# Altium schematic sheet Schematics_5.SchDoc
size 699 x 600 mm; SheetNumber: 1; SheetTotal: 1
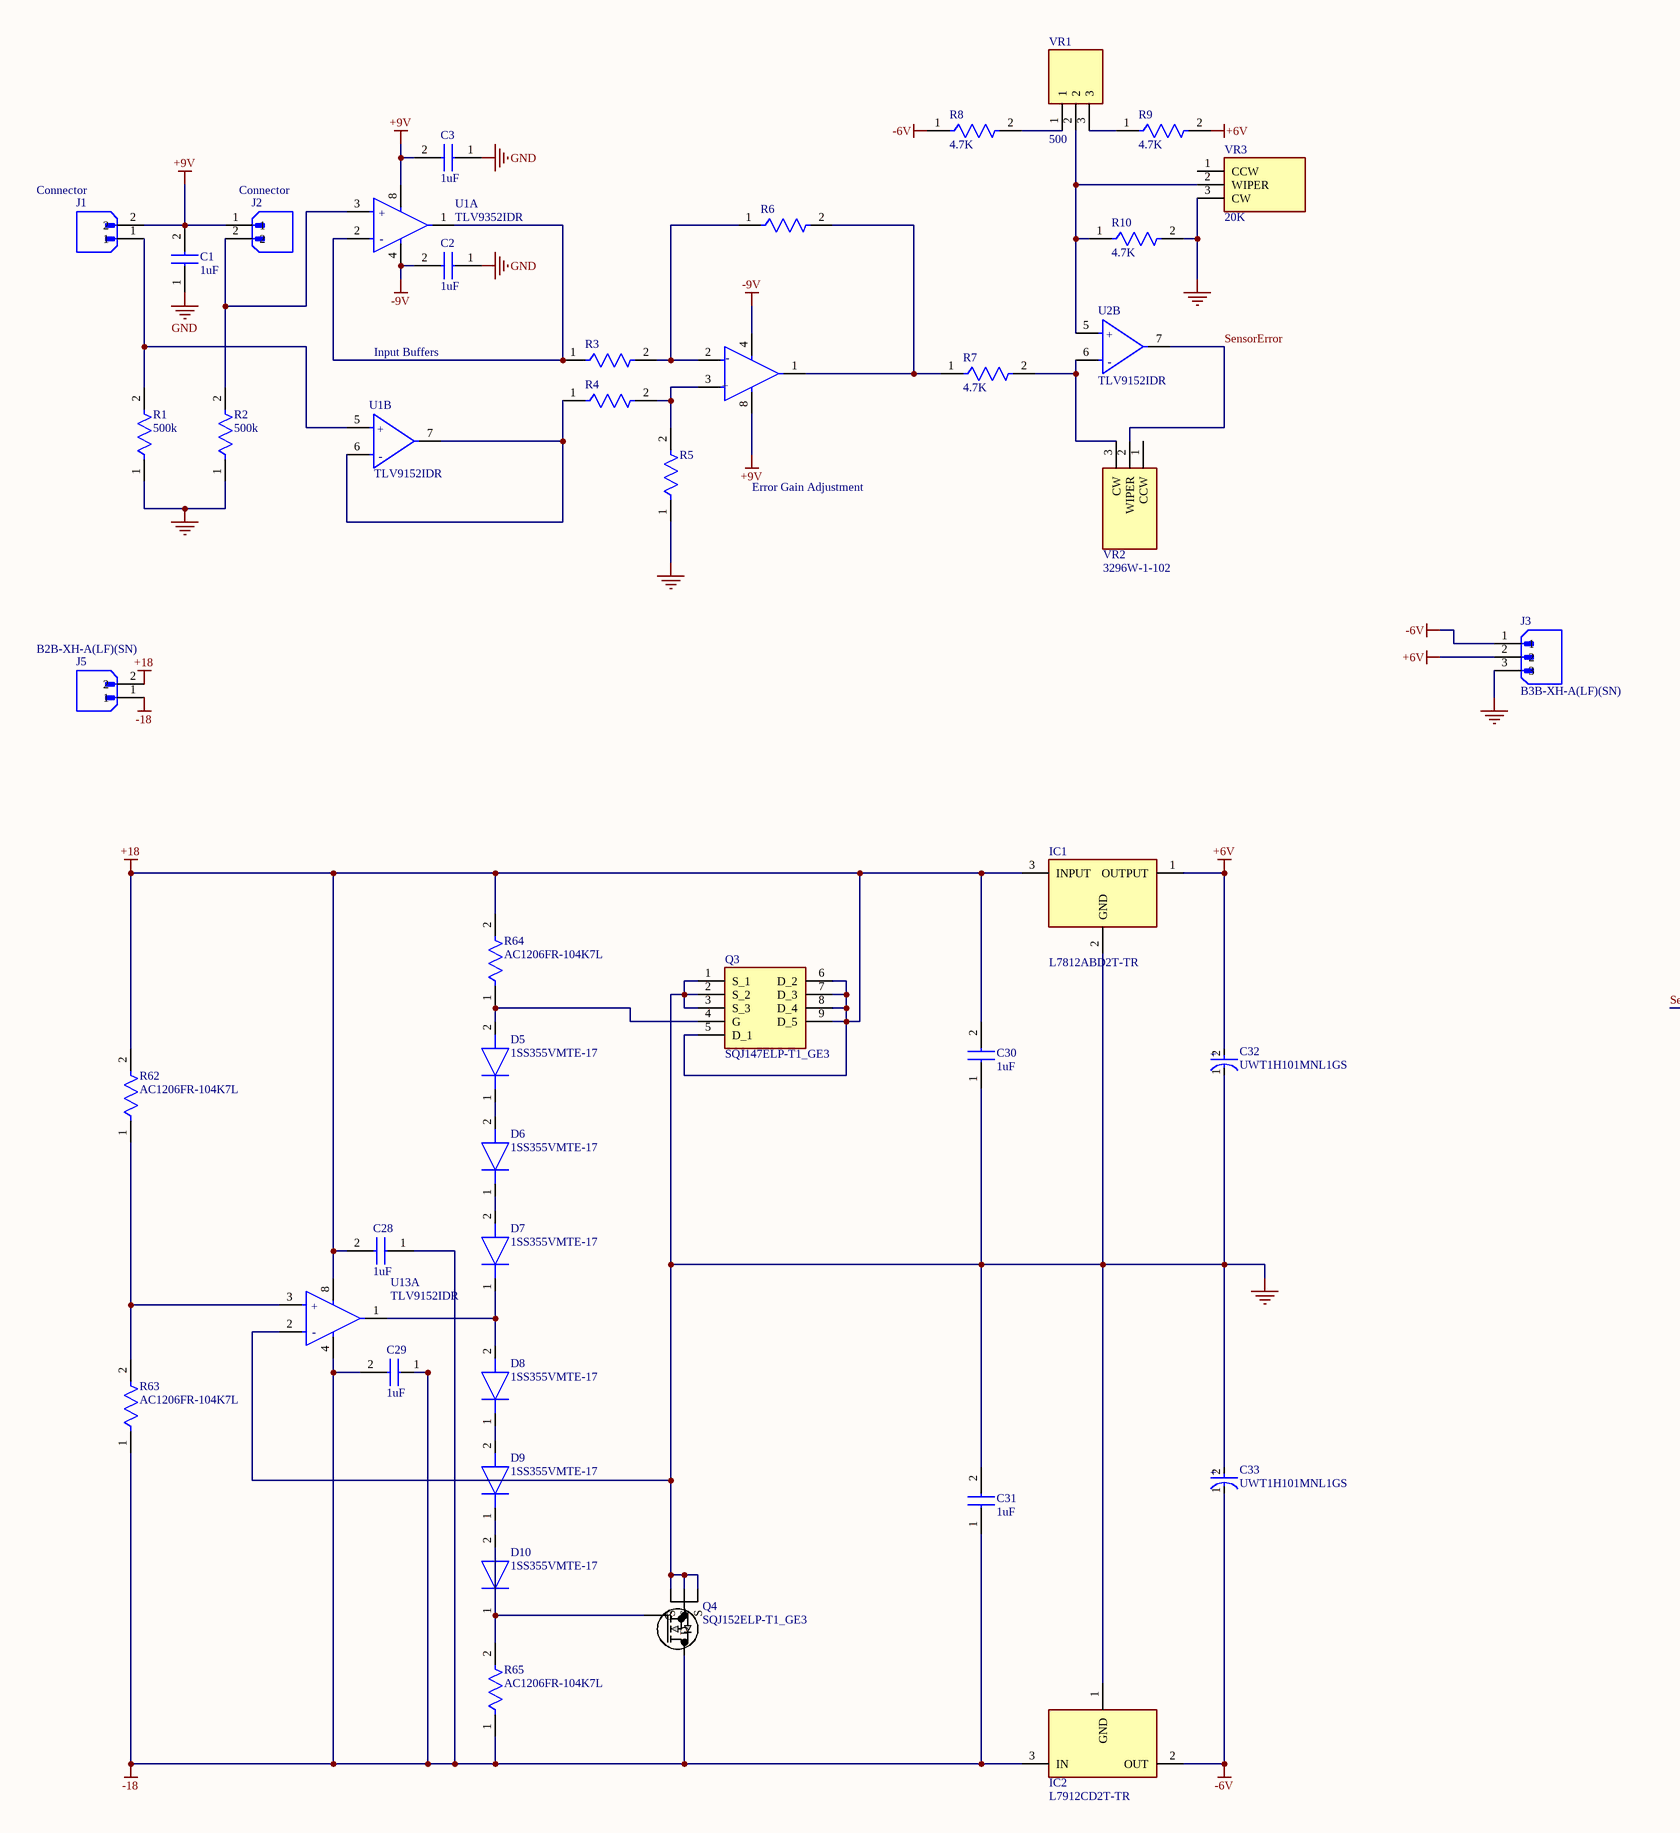
[diagram p0: Schematics_5.SchDoc, top left]
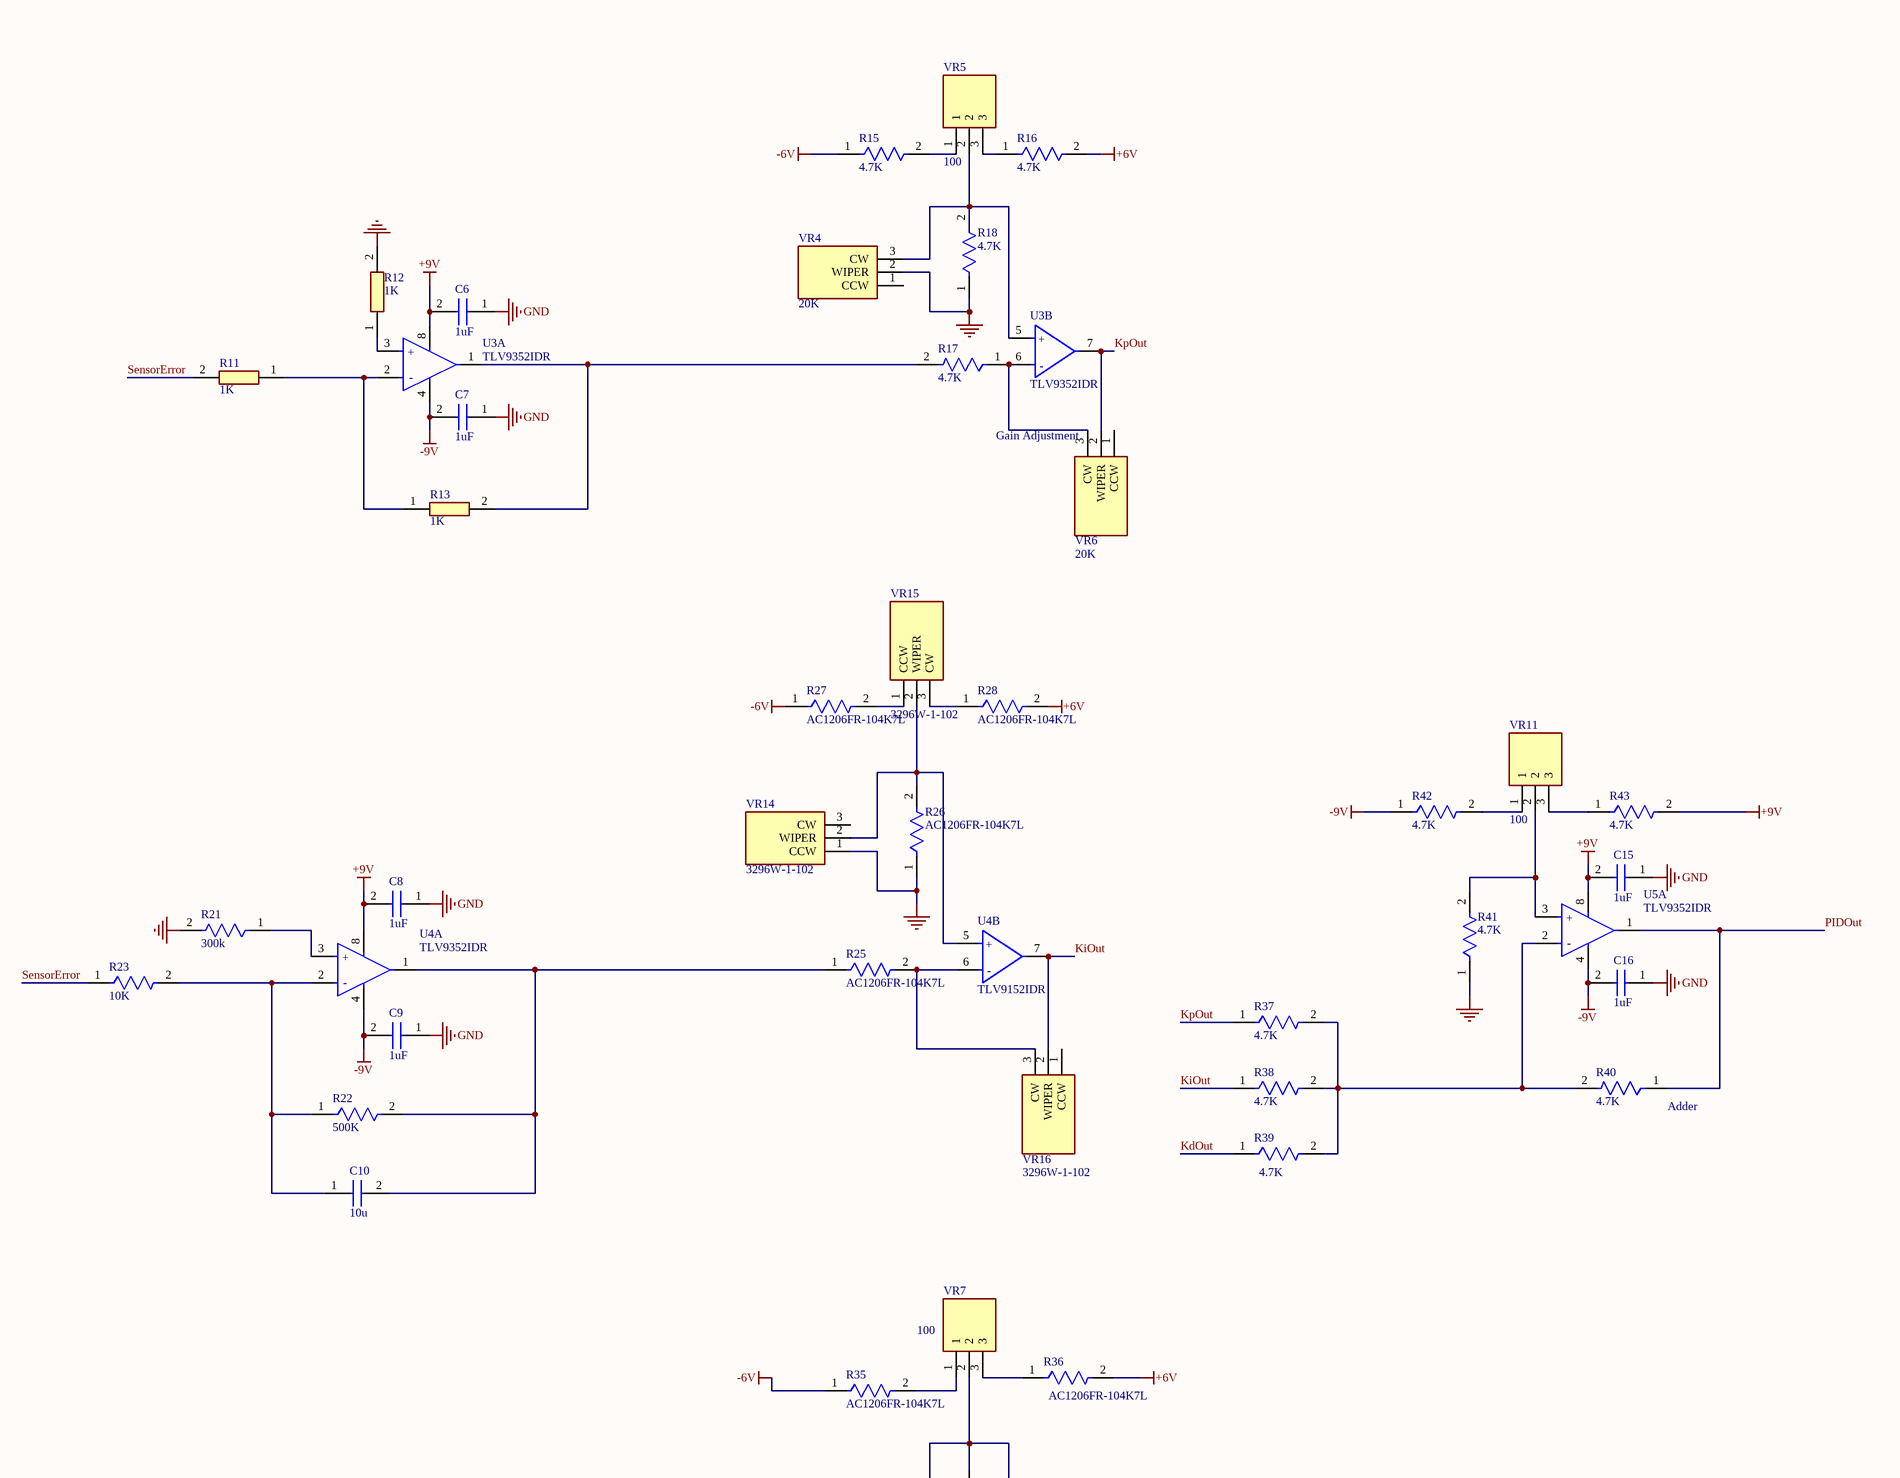
[diagram p1: Schematics_5.SchDoc, top right]
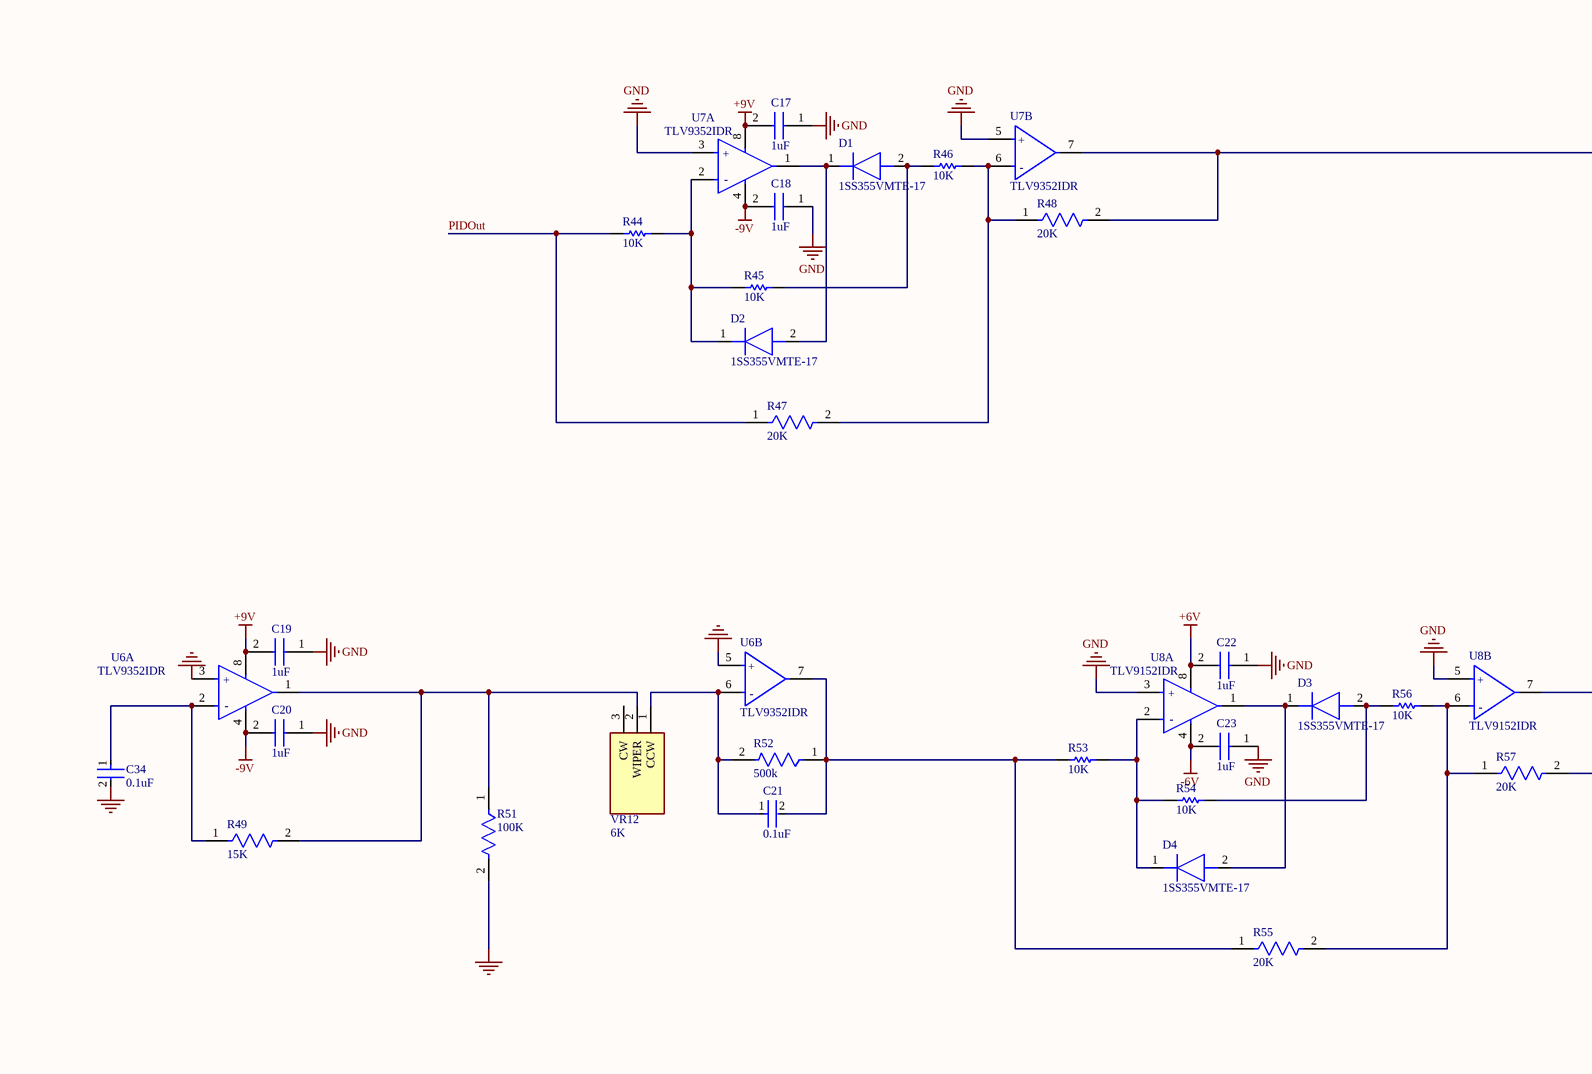
[diagram p2: Schematics_5.SchDoc, bottom left]
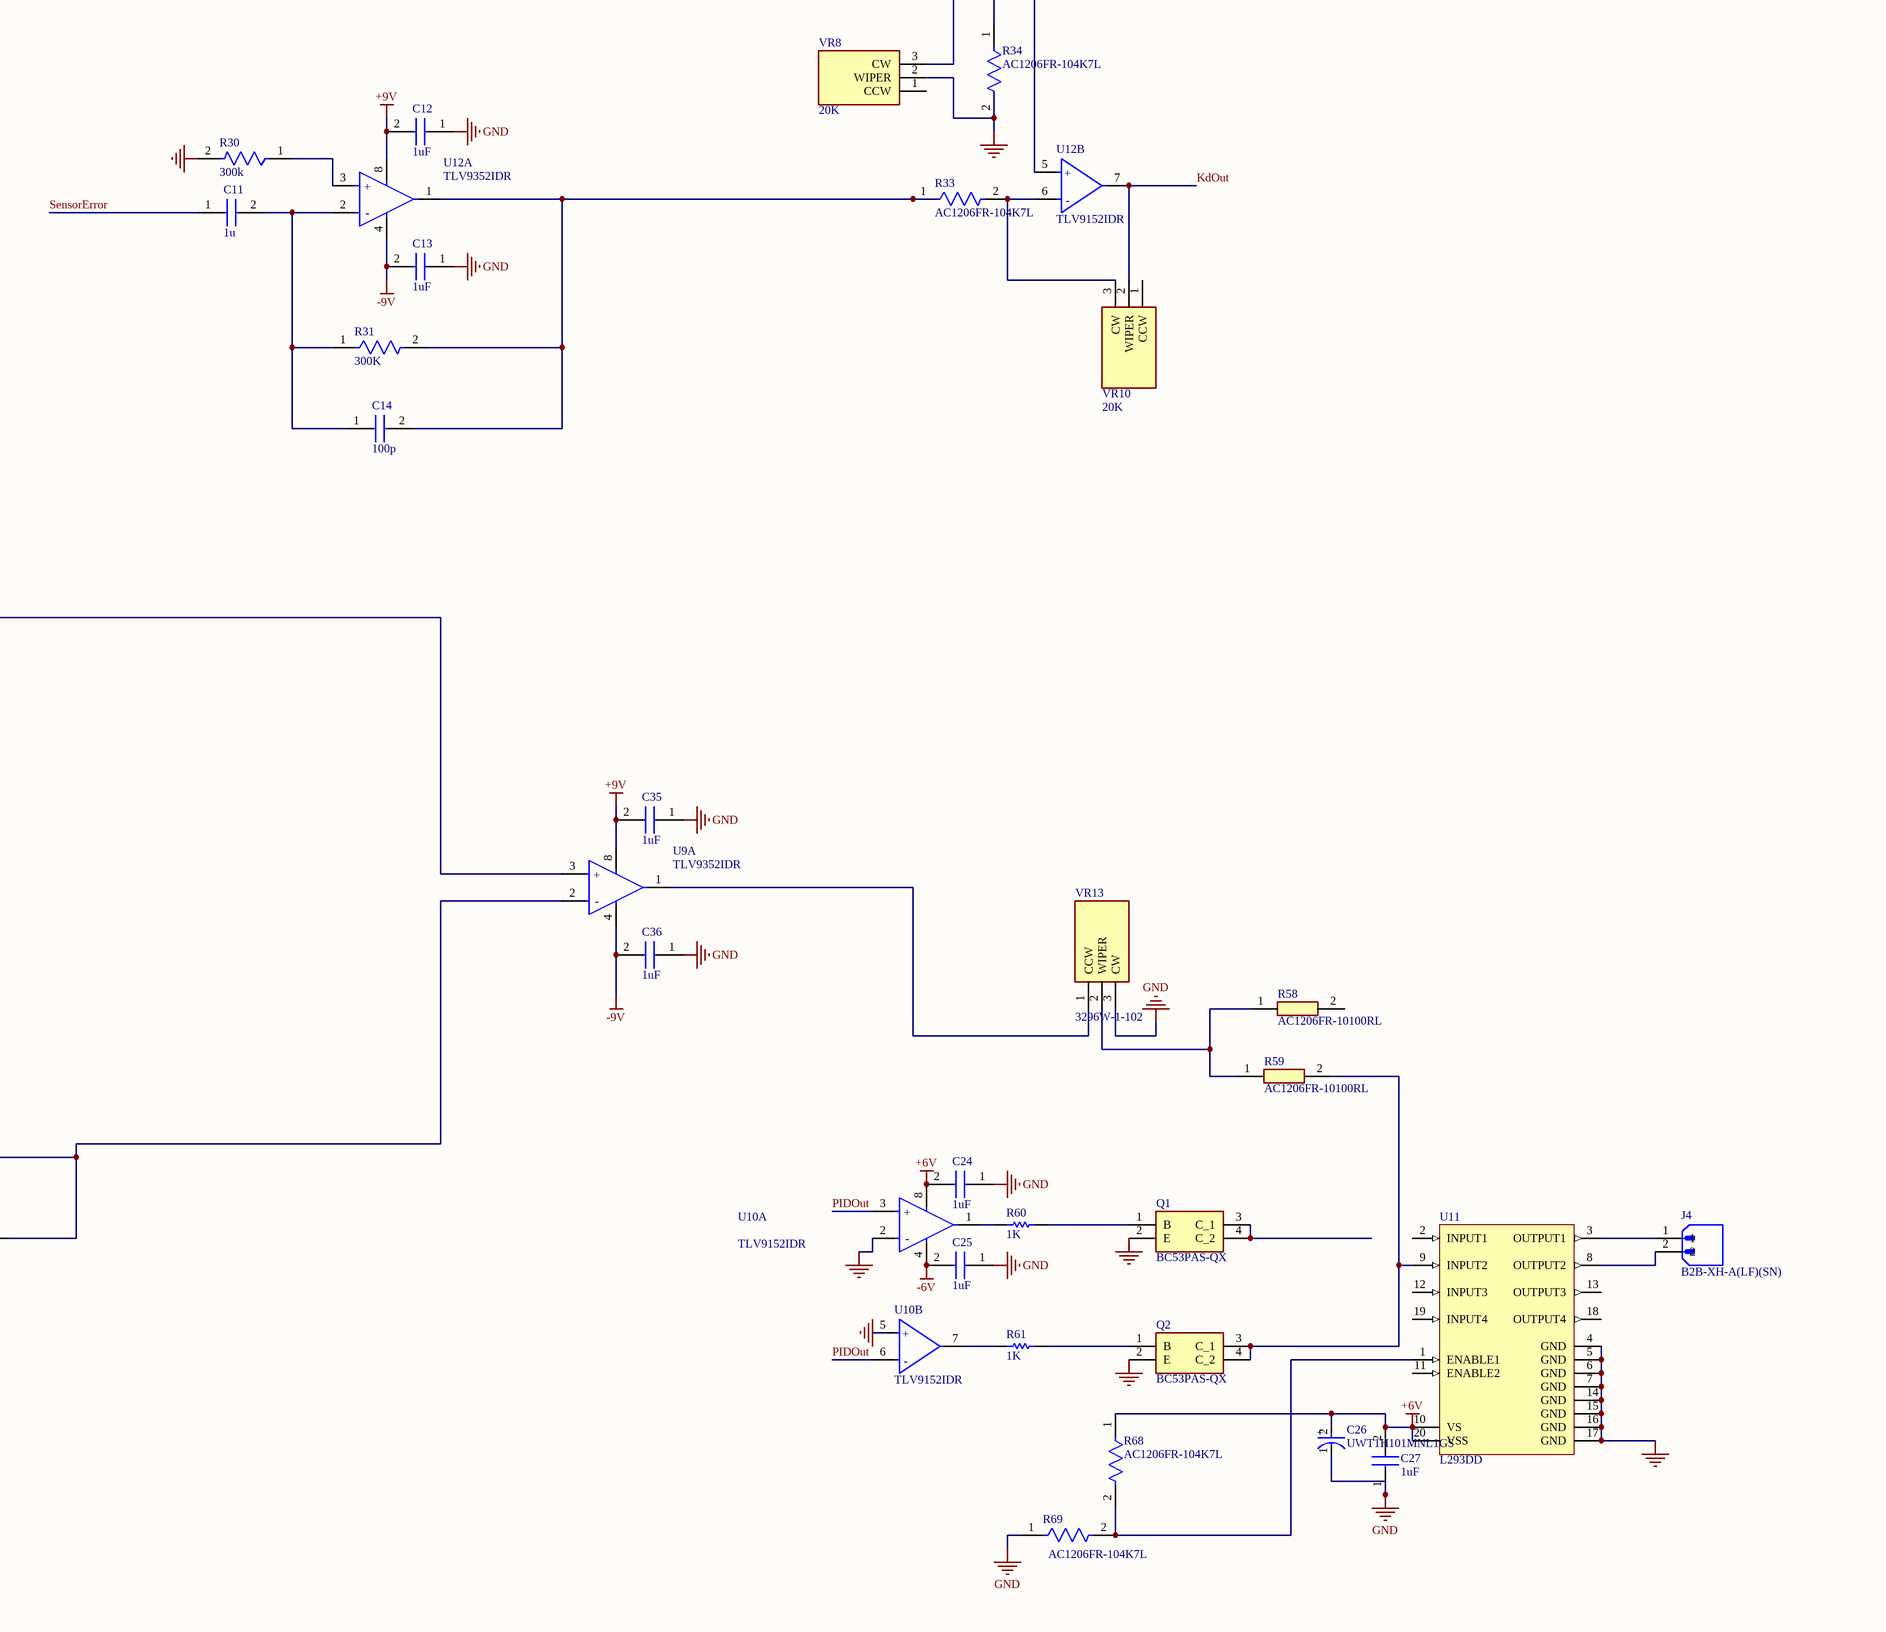
[diagram p3: Schematics_5.SchDoc, bottom right]

## Parts
C1  1uF  [CAPC3216X178N]
C2  1uF  [CAPC3216X178N]
C3  1uF  [CAPC3216X178N]
C6  1uF  [CAPC3216X178N]
C7  1uF  [CAPC3216X178N]
C8  1uF  [CAPC3216X178N]
C9  1uF  [CAPC3216X178N]
C10  10u  [CAPC3216X170N]
C11  1u  [C1206_FT]
C12  1uF  [CAPC3216X178N]
C13  1uF  [CAPC3216X178N]
C14  100p  [CAPC3216X170N]
C15  1uF  [CAPC3216X178N]
C16  1uF  [CAPC3216X178N]
C17  1uF  [CAPC3216X178N]
C18  1uF  [CAPC3216X178N]
C19  1uF  [CAPC3216X178N]
C20  1uF  [CAPC3216X178N]
C21  0.1uF  [FP-C1206C-EB-MFG]
C22  1uF  [CAPC3216X178N]
C23  1uF  [CAPC3216X178N]
C24  1uF  [CAPC3216X178N]
C25  1uF  [CAPC3216X178N]
C26  UWT1H101MNL1GS  [FP-UWT1H101MNL1GS-MFG]
C27  1uF  [CAPC3216X178N]
C28  1uF  [CAPC3216X178N]
C29  1uF  [CAPC3216X178N]
C30  1uF  [CAPC3216X178N]
C31  1uF  [CAPC3216X178N]
C32  UWT1H101MNL1GS  [FP-UWT1H101MNL1GS-MFG]
C33  UWT1H101MNL1GS  [FP-UWT1H101MNL1GS-MFG]
C34  0.1uF  [FP-C1206C-EB-MFG]
C35  1uF  [CAPC3216X178N]
C36  1uF  [CAPC3216X178N]
D1  1SS355VMTE-17  [UDZVTE1722B]
D2  1SS355VMTE-17  [UDZVTE1722B]
D3  1SS355VMTE-17  [UDZVTE1722B]
D4  1SS355VMTE-17  [UDZVTE1722B]
D5  1SS355VMTE-17  [UDZVTE1722B]
D6  1SS355VMTE-17  [UDZVTE1722B]
D7  1SS355VMTE-17  [UDZVTE1722B]
D8  1SS355VMTE-17  [UDZVTE1722B]
D9  1SS355VMTE-17  [UDZVTE1722B]
D10  1SS355VMTE-17  [UDZVTE1722B]
IC1  L7812ABD2T-TR  [L7812ABD2TTR]
IC2  L7912CD2T-TR  [L7905CD2TTR]
J1  Connector  [JST_B2B-XH-A(LF)(SN)]
J2  Connector  [JST_B2B-XH-A(LF)(SN)]
J3  B3B-XH-A(LF)(SN)  [JST_B3B-XH-A(LF)(SN)]
J4  B2B-XH-A(LF)(SN)  [JST_B2B-XH-A(LF)(SN)]
J5  B2B-XH-A(LF)(SN)  [JST_B2B-XH-A(LF)(SN)]
Q1  BC53PAS-QX  [BC53PASQX]
Q2  BC53PAS-QX  [BC53PASQX]
Q3  SQJ147ELP-T1_GE3  [SQJ147ELPT1_GE3]
Q4  SQJ152ELP-T1_GE3  [DPAK5_ELP-T1_GE3_VIS]
R1  500k  [FP-CRMA1206-IPC_A]
R2  500k  [FP-CRMA1206-IPC_A]
R3  4.7K  [FP-AC1206-MFG]  (value not drawn)
R4  4.7K  [FP-AC1206-MFG]  (value not drawn)
R5  4.7K  [FP-AC1206-MFG]  (value not drawn)
R6  4.7K  [FP-AC1206-MFG]  (value not drawn)
R7  4.7K  [FP-AC1206-MFG]
R8  4.7K  [FP-AC1206-MFG]
R9  4.7K  [FP-AC1206-MFG]
R10  4.7K  [FP-AC1206-MFG]
R11  1K  [RESC3116X65N]
R12  1K  [RESC3116X65N]
R13  1K  [RESC3116X65N]
R15  4.7K  [FP-AC1206-MFG]
R16  4.7K  [FP-AC1206-MFG]
R17  4.7K  [FP-AC1206-MFG]
R18  4.7K  [FP-AC1206-MFG]
R21  300k  [FP-ESR18-IPC_C]
R22  500K  [FP-ESR18-IPC_C]
R23  10K  [FP-ESR18-IPC_C]
R25  AC1206FR-104K7L  [FP-AC1206-MFG]
R26  AC1206FR-104K7L  [FP-AC1206-MFG]
R27  AC1206FR-104K7L  [FP-AC1206-MFG]
R28  AC1206FR-104K7L  [FP-AC1206-MFG]
R30  300k  [FP-ESR18-IPC_C]
R31  300K  [FP-ESR18-IPC_C]
R33  AC1206FR-104K7L  [FP-AC1206-MFG]
R34  AC1206FR-104K7L  [FP-AC1206-MFG]
R35  AC1206FR-104K7L  [FP-AC1206-MFG]
R36  AC1206FR-104K7L  [FP-AC1206-MFG]
R37  4.7K  [FP-AC1206-MFG]
R38  4.7K  [FP-AC1206-MFG]
R39  4.7K  [FP-AC1206-MFG]
R40  4.7K  [FP-AC1206-MFG]
R41  4.7K  [FP-AC1206-MFG]
R42  4.7K  [FP-AC1206-MFG]
R43  4.7K  [FP-AC1206-MFG]
R44  10K  [RESC3116X65X40ML10T20]
R45  10K  [RESC3116X65X40ML10T20]
R46  10K  [RESC3116X65X40ML10T20]
R47  20K  [FP-RT1206-MFG]
R48  20K  [FP-RT1206-MFG]
R49  15K  [FP-ERJ8EN-MFG]
R51  100K  [FP-AC1206-MFG]
R52  500k  [FP-CRMA1206-IPC_A]
R53  10K  [RESC3116X65X40ML10T20]
R54  10K  [RESC3116X65X40ML10T20]
R55  20K  [FP-RT1206-MFG]
R56  10K  [RESC3116X65X40ML10T20]
R57  20K  [FP-RT1206-MFG]
R58  AC1206FR-10100RL  [RESC3116X65N]
R59  AC1206FR-10100RL  [RESC3116X65N]
R60  1K  [RESC3216X70X50LL05T20]
R61  1K  [RESC3216X70X50LL05T20]
R62  AC1206FR-104K7L  [FP-AC1206-MFG]
R63  AC1206FR-104K7L  [FP-AC1206-MFG]
R64  AC1206FR-104K7L  [FP-AC1206-MFG]
R65  AC1206FR-104K7L  [FP-AC1206-MFG]
R68  AC1206FR-104K7L  [FP-AC1206-MFG]
R69  AC1206FR-104K7L  [FP-AC1206-MFG]
U1  TLV9352IDR  [FP-D0008A-IPC_A]  (parts A,B of 2)
U2  TLV9352IDR  [FP-D0008A-IPC_A]  (value not drawn)  (parts A,B of 2)
U3  TLV9352IDR  [FP-D0008A-IPC_A]  (parts A,B of 2)
U4  TLV9352IDR  [FP-D0008A-IPC_A]  (parts A,B of 2)
U5  TLV9352IDR  [FP-D0008A-IPC_A]  (part A of 2)
U6  TLV9352IDR  [FP-D0008A-IPC_A]  (parts A,B of 2)
U7  TLV9352IDR  [FP-D0008A-IPC_A]  (parts A,B of 2)
U8  TLV9152IDR  [FP-D0008A-IPC_A]  (parts A,B of 2)
U9  TLV9352IDR  [FP-D0008A-IPC_A]  (part A of 2)
U10  TLV9152IDR  [FP-D0008A-IPC_A]  (parts A,B of 2)
U11  L293DD  [STM-SOIC-20_M]
U12  TLV9352IDR  [FP-D0008A-IPC_A]  (parts A,B of 2)
U13  TLV9152IDR  [FP-D0008A-IPC_A]  (part A of 2)
VR1  500  [3296W-1]
VR2  3296W-1-102  [3296W-1]
VR3  20K  [3296W-1]
VR4  20K  [3296W-1]
VR5  100  [3296W-1]
VR6  20K  [3296W-1]
VR7  100  [3296W-1]
VR8  20K  [3296W-1]
VR10  20K  [3296W-1]
VR11  100  [3296W-1]
VR12  6K  [3296W-1]
VR13  3296W-1-102  [3296W-1]
VR14  3296W-1-102  [3296W-1]
VR15  3296W-1-102  [3296W-1]
VR16  3296W-1-102  [3296W-1]

## Nets
+6V: C22.2 C24.2 C26.2(A) C27.2 C32.2(A) IC1.1(OUTPUT) J3.2 R9.2 R16.2 R28.2 R36.2 R68.1 U8.8(V+) U10.8(V+) U11.10(VS) U11.20(VSS)
+9V: C1.2 C3.2 C6.2 C8.2 C12.2 C15.2 C17.2 C19.2 C35.2 J1.2 J2.1 R43.2 U1.8(V+) U2.8(V+) U3.8(V+) U4.8(V+) U5.8(V+) U6.8(V+) U7.8(V+) U9.8(V+) U12.8(V+)
+18: C28.2 C30.2 IC1.3(INPUT) J5.2 Q3.5(D_1) Q3.6(D_2) Q3.7(D_3) Q3.8(D_4) Q3.9(D_5) R62.2 R64.2 U13.8(V+)
-6V: C23.2 C25.2 C33.1(C) IC2.2(OUT) J3.1 R8.1 R15.1 R27.1 R35.1 U8.4(V-) U10.4(V-)
-9V: C2.2 C7.2 C9.2 C13.2 C16.2 C18.2 C20.2 C36.2 R42.1 U1.4(V-) U2.4(V-) U3.4(V-) U4.4(V-) U5.4(V-) U6.4(V-) U7.4(V-) U9.4(V-) U12.4(V-)
-18: C28.1 C29.1 C29.2 C31.1 IC2.3(IN) J5.1 Q4.5(D) R63.1 R65.1 U13.4(V-)
GND: C1.1 C2.1 C3.1 C6.1 C7.1 C8.1 C9.1 C12.1 C13.1 C15.1 C16.1 C17.1 C18.1 C19.1 C20.1 C22.1 C23.1 C24.1 C25.1 C26.1(C) C27.1 C30.1 C31.2 C32.1(C) C33.2(A) C34.2 C35.1 C36.1 IC1.2(GND) IC2.1(GND) J3.3 Q1.2(E) Q2.2(E) Q3.1(S_1) Q3.2(S_2) Q3.3(S_3) Q4.1(S) Q4.2(S) Q4.3(S) R1.1 R2.1 R5.1 R10.2 R12.2 R18.1 R21.2 R26.1 R30.2 R34.2 R41.1 R51.2 R69.1 U6.3(IN1+) U6.5(IN2+) U7.3(IN1+) U7.5(IN2+) U8.3(IN1+) U8.5(IN2+) U10.2(IN1-) U10.5(IN2+) U11.4(GND) U11.5(GND) U11.6(GND) U11.7(GND) U11.14(GND) U11.15(GND) U11.16(GND) U11.17(GND) U13.2(IN1-) VR3.3(CW) VR4.2(WIPER) VR8.2(WIPER) VR13.3(CW) VR14.1(CCW)
KdOut: R39.1 U12.7(OUT2) VR10.2(WIPER)
KiOut: R38.1 U4.7(OUT2) VR16.2(WIPER)
KpOut: R37.1 U3.7(OUT2) VR6.2(WIPER)
PIDOut: R40.1 R44.1 R47.1 U5.1(OUT1) U10.3(IN1+) U10.6(IN2-)
SensorError: C11.1 R11.2 R23.1 U2.7(OUT2) VR2.2(WIPER)
NetC10_1: C10.1 R22.1 R23.2 U4.2(IN1-)
NetC10_2: C10.2 R22.2 R25.1 U4.1(OUT1)
NetC11_2: C11.2 C14.1 R31.1 U12.2(IN1-)
NetC14_2: C14.2 R31.2 R33.1 U12.1(OUT1)
NetC21_1: C21.1 R52.2 U6.6(IN2-) VR12.1(CCW)
NetC21_2: C21.2 R52.1 R53.1 R55.1 U6.7(OUT2)
NetC34_1: C34.1 R49.1 U6.2(IN1-)
NetD1_1: D1.1(K) D2.2(A) U7.1(OUT1)
NetD1_2: D1.2(A) R45.2 R46.1
NetD2_1: D2.1(K) R44.2 R45.1 U7.2(IN1-)
NetD3_1: D3.1(K) D4.2(A) U8.1(OUT1)
NetD3_2: D3.2(A) R54.2 R56.1
NetD4_1: D4.1(K) R53.2 R54.1 U8.2(IN1-)
NetD5_1: D5.1(K) D6.2(A)
NetD5_2: D5.2(A) Q3.4(G) R64.1
NetD6_1: D6.1(K) D7.2(A)
NetD7_1: D7.1(K) D8.2(A) U13.1(OUT1)
NetD8_1: D8.1(K) D9.2(A)
NetD9_1: D9.1(K) D10.2(A)
NetD10_1: D10.1(K) Q4.4(G) R65.2
NetJ1_1: J1.1 R1.2 U1.5(IN2+)
NetJ2_2: J2.2 R2.2 U1.3(IN1+)
NetJ4_1: J4.1 U11.3(OUTPUT1)
NetJ4_2: J4.2 U11.8(OUTPUT2)
NetQ1_1: Q1.1(B) R60.2
NetQ1_3: Q1.3(C_1) Q1.4(C_2)
NetQ2_1: Q2.1(B) R61.2
NetQ2_3: Q2.3(C_1) Q2.4(C_2) R59.2 U11.9(INPUT2)
NetR3_1: R3.1 U1.1(OUT1) U1.2(IN1-)
NetR3_2: R3.2 R6.1 U2.2(IN1-)
NetR4_1: R4.1 U1.6(IN2-) U1.7(OUT2)
NetR4_2: R4.2 R5.2 U2.3(IN1+)
NetR6_2: R6.2 R7.1 U2.1(OUT1)
NetR7_2: R7.2 U2.6(IN2-) VR2.3(CW)
NetR8_2: R8.2 VR1.1
NetR9_1: R9.1 VR1.3
NetR10_1: R10.1 U2.5(IN2+) VR1.2 VR3.2(WIPER)
NetR11_1: R11.1 R13.1 U3.2(IN1-)
NetR12_1: R12.1 U3.3(IN1+)
NetR13_2: R13.2 R17.2 U3.1(OUT1)
NetR15_2: R15.2 VR5.1
NetR16_1: R16.1 VR5.3
NetR17_1: R17.1 U3.6(IN2-) VR6.3(CW)
NetR18_2: R18.2 U3.5(IN2+) VR4.3(CW) VR5.2
NetR21_1: R21.1 U4.3(IN1+)
NetR25_2: R25.2 U4.6(IN2-) VR16.3(CW)
NetR26_2: R26.2 U4.5(IN2+) VR14.2(WIPER) VR15.2(WIPER)
NetR27_2: R27.2 VR15.1(CCW)
NetR28_1: R28.1 VR15.3(CW)
NetR30_1: R30.1 U12.3(IN1+)
NetR33_2: R33.2 U12.6(IN2-) VR10.3(CW)
NetR34_1: R34.1 U12.5(IN2+) VR7.2 VR8.3(CW)
NetR35_2: R35.2 VR7.1
NetR36_1: R36.1 VR7.3
NetR37_2: R37.2 R38.2 R39.2 R40.2 U5.2(IN1-)
NetR41_2: R41.2 U5.3(IN1+) VR11.2
NetR42_2: R42.2 VR11.1
NetR43_1: R43.1 VR11.3
NetR46_2: R46.2 R47.2 R48.1 U7.6(IN2-)
NetR48_2: R48.2 U7.7(OUT2) U9.3(IN1+)
NetR49_2: R49.2 R51.1 U6.1(OUT1) VR12.2(WIPER)
NetR55_2: R55.2 R56.2 R57.1 U8.6(IN2-)
NetR57_2: R57.2 U8.7(OUT2) U9.2(IN1-)
NetR58_1: R58.1 R59.1 VR13.2(WIPER)
NetR60_1: R60.1 U10.1(OUT1)
NetR61_1: R61.1 U10.7(OUT2)
NetR62_1: R62.1 R63.2 U13.3(IN1+)
NetR68_2: R68.2 R69.2 U11.1(ENABLE1)
NetU9_1: U9.1(OUT1) VR13.1(CCW)

Not connected (* = marked no-connect by the designer): R58 2; U11 2(INPUT1) 11(ENABLE2) 12(INPUT3) 13(OUTPUT3) 18(OUTPUT4) 19(INPUT4); VR2 1(CCW); VR3 1(CCW); VR4 1(CCW); VR6 1(CCW); VR8 1(CCW); VR10 1(CCW); VR12 3(CW); VR14 3(CW); VR16 1(CCW)

## Notes on the sheet
- Input Buffers
- (near VR6) Gain Adjustment
- Error Gain Adjustment
- (near R40) Adder
- (in symbol CMP-2000-07373-2) +
- (in symbol CMP-04895-000148-1, part A) +; -
- (in symbol CMP-04895-000148-1, part B) +; -

## Library data of the parts
C1-C3 C6-C9 C12 C13 C15-C20 C22-C25 C27-C31 C35 C36 = 12063C105MAT2A: Capacitor 12063C105MAT2A; Manufacturer_Name: AVX; Datasheet Link: https://spicat.kyocera-avx.com/product/mlcc/chartview/12063C105MAT2A/DataSheet/X7R; Height: 1.78mm; Manufacturer_Part_Number: 12063C105MAT2A; Mouser Part Number: 581-12063C105MAT2A; Mouser Price/Stock: https://www.mouser.com/Search/Refine.aspx?Keyword=581-12063C105MAT2A; Arrow Part Number: 12063C105MAT2A; Arrow Price/Stock: https://www.arrow.com/en/products/12063c105mat2a/avx
C10 C14 = VJ1206A101JXEAT: Capacitor; Manufacturer_Name: Vishay; Datasheet Link: http://www.vishay.com/docs/45200/vjhirelseries.pdf; Height: 1.7mm; Manufacturer_Part_Number: VJ1206A101JXEAT; Mouser Part Number: 77-VJ1206A101JXEAT; Mouser Price/Stock: https://www.mouser.co.uk/ProductDetail/Vishay-Vitramon/VJ1206A101JXEAT?qs=RFK7ThnmtPvk1pY6DbPviw%3D%3D; Arrow Part Number: VJ1206A101JXEAT; Arrow Price/Stock: https://www.arrow.com/en/products/vj1206a101jxeat/vishay
C11 = C1206X105J1RACTU: Capacitor; Manufacturer_Name: KEMET; Datasheet Link: https://content.kemet.com/datasheets/KEM_C1013_X7R_FT-CAP_SMD.pdf; Manufacturer_Part_Number: C1206X105J1RACTU; Mouser Part Number: 80-C1206X105J1R; Mouser Price/Stock: https://www.mouser.co.uk/ProductDetail/KEMET/C1206X105J1RACTU?qs=s6nfgz3miVxU9JVY4HzXlQ%3D%3D
C21 C34 = CMP-1037-04186-2: CAP CER 0.1UF 25V C0G/NP0 1206; Manufacturer: KEMET; Manufacturer Part Number: C1206C104F3GACTU; Material: Ceramic; Value: 0.10 μF; Temperature Characteristic: C0G; Temperature Coefficient: 15%; Tolerance: 0.01; Automotive Grade: Grade 0; Device Class L3: Ceramic Capacitors; Voltage Rating: 25 V; Temperature Range Low: -55°C; RoHS: TRUE; Package: C1206C-EB; Category: Cap; Lead Free: Yes; ComponentLink2URL: https://content.kemet.com/datasheets/KEM_C1007_X8R_ULTRA_150C_SMD.pdf; Ipc Land Pattern Name: CAPC320160X78; Temperature Range High: +150°C; Height: 0.88mm; Digikey Description: CAP CER 0.1UF 25V C0G/NP0 1206; ComponentLink2Description: Datasheet; Capacitance: 0.10 μF; Mouser Description: Multilayer Ceramic Capacitors MLCC - SMD/SMT 25volts 0.1uF 1% C0G; Octopart: https://octopart.com/c1206c104f3gactu-kemet-13149870; Device Class L1: Passive Components; Device Class L2: Capacitors; Automotive: Yes; Temperature: -55°C to +150°C
C26 C32 C33 = CMP-2000-07373-2: CAP ALUM 100UF 20% 50V SMD; Leakage Current: 3uA; Ripple Current: 140mA; Life (Hours): 1000Hour; Dissipation Factor: 0.14%; Dielectric Material: Aluminium; Termination: SMD/SMT; Tolerance: 20%; Package Quantity: 500; Capacitance: 100uF; Height: 10mm; REACH SVHC: No SVHC; Case/Package: Radial; Series: WT; Diameter: 8mm; Voltage Rating: 50V; Construction: Cylindrical; Length: 10mm; Min Operating Temperature: -55°C; Max Operating Temperature: 105°C; Voltage Rating (DC): 50V; Packaging: Tape and Reel; Voltage: 50V; Mount: Surface Mount; Ripple Current (AC): 140mA; Radiation Hardening: No; Number of Pins: 2; Lead Free: Lead Free; Height - Seated (Max): 0.413inch; RoHS Compliant: Yes
D1-D10 = 1SS355VMTE-17: Diode; Manufacturer_Name: ROHM Semiconductor; Datasheet Link: https://datasheet.datasheetarchive.com/originals/distributors/Datasheets_SAMA/726503b2436a9ce4bc644e4966373f1b.pdf; Height: 0mm; Manufacturer_Part_Number: 1SS355VMTE-17; Mouser Part Number: 755-1SS355VMTE-17; Mouser Price/Stock: https://www.mouser.co.uk/ProductDetail/ROHM-Semiconductor/1SS355VMTE-17?qs=IsRgwgmxh693733hapxfjA%3D%3D
IC1 = L7812ABD2T-TR: Integrated Circuit; Manufacturer_Name: STMicroelectronics; Datasheet Link: https://componentsearchengine.com/Datasheets/1/L7812ABD2T-TR.pdf; Height: 4.7mm; Manufacturer_Part_Number: L7812ABD2T-TR; Mouser Part Number: 511-L7812ABD2T-TR; Mouser Price/Stock: https://www.mouser.co.uk/ProductDetail/STMicroelectronics/L7812ABD2T-TR?qs=llfGyK1OjE3hWetai%252BQcKg%3D%3D; Arrow Part Number: L7812ABD2T-TR; Arrow Price/Stock: https://www.arrow.com/en/products/l7812abd2t-tr/stmicroelectronics?region=europe
IC2 = L7912CD2T-TR: Integrated Circuit; Manufacturer_Name: STMicroelectronics; Datasheet Link: http://www.st.com/web/en/resource/technical/document/datasheet/CD00000450.pdf; Height: 4.6mm; Manufacturer_Part_Number: L7912CD2T-TR; Mouser Part Number: 511-L7912CD2T-TR; Mouser Price/Stock: https://www.mouser.co.uk/ProductDetail/STMicroelectronics/L7912CD2T-TR?qs=3sbPgdekz232r2AmOaAD%252Bg%3D%3D; Arrow Part Number: L7912CD2T-TR; Arrow Price/Stock: https://www.arrow.com/en/products/l7912cd2t-tr/stmicroelectronics?region=nac
J1 J2 J4 J5 = B2B-XH-A(LF)(SN): Connector Header Through Hole 2 position 0.098 (2.50mm); MF: JST Sales America Inc.; SnapEDA_Link: https://www.snapeda.com/parts/B2B-XH-A(LF)(SN)/JST+Sales+America+Inc./view-part/?ref=snap; Package: None; Value: *; MP: B2B-XH-A(LF)(SN); Check_prices: https://www.snapeda.com/parts/B2B-XH-A(LF)(SN)/JST+Sales+America+Inc./view-part/?ref=eda
J3 = B3B-XH-A(LF)(SN): Connector Header Through Hole 3 position 0.098 (2.50mm); MF: JST Sales; Check_prices: https://www.snapeda.com/parts/B3B-XH-A(LF)(SN)/JST+Sales+America+Inc./view-part/?ref=eda; Value: *; Availability: In Stock; MP: B3B-XH-A(LF)(SN); Price: None; Package: None; SnapEDA_Link: https://www.snapeda.com/parts/B3B-XH-A(LF)(SN)/JST+Sales+America+Inc./view-part/?ref=snap; Purchase-URL: https://pricing.snapeda.com/search/part/B3B-XH-A(LF)(SN)/?ref=eda
Q1 Q2 = BC53PAS-QX: Transistor BJT PNP; Manufacturer_Name: Nexperia; Datasheet Link: https://assets.nexperia.com/documents/data-sheet/BC53XPAS-Q_SER.pdf; Height: 0.65mm; Manufacturer_Part_Number: BC53PAS-QX; Mouser Part Number: 771-BC53PAS-QX; Mouser Price/Stock: https://www.mouser.co.uk/ProductDetail/Nexperia/BC53PAS-QX?qs=Y0Uzf4wQF3mcJPegYmfiPg%3D%3D
Q3 = SQJ147ELP-T1_GE3: MOSFET (N-Channel); Manufacturer_Name: Vishay; Datasheet Link: https://www.vishay.com/docs/77857/sqj147elp.pdf; Height: 1.227mm; Manufacturer_Part_Number: SQJ147ELP-T1_GE3; Mouser Part Number: 78-SQJ147ELP-T1_GE3; Mouser Price/Stock: https://www.mouser.co.uk/ProductDetail/Vishay-Siliconix/SQJ147ELP-T1_GE3?qs=81r%252BiQLm7BRdyhBg3DuaKw%3D%3D; Arrow Part Number: SQJ147ELP-T1_GE3; Arrow Price/Stock: https://www.arrow.com/en/products/sqj147elp-t1-ge3/vishay?region=nac
Q4 = SQJ152ELP-T1_GE3: No Description Available; Mfr_Name: Vishay; Type: DEV; Copyright: Copyright (C) 2023 Ultra Librarian. All rights reserved.; Manufacturer_Part_Number: SQJ152ELP-T1_GE3; RefDes: RefDes
R1 R2 R52 = CMP-00030-87449095-1: CRMA1206AF500KFKEF Res Thick Film 1206 500K Ohm 1% 0.3W ±100ppm/C Pad SMD Automotive T/R; Power Rating: 300mW; Temperature Coefficient: 100ppm/°C; Voltage Rating: 1kV; Resistance: 500kΩ; Height: 740µm; Schedule B: 8533210045, 8533210045; Case/Package: 1206; Max Operating Temperature: 155°C; Min Operating Temperature: -55°C; Tolerance: 1%; Composition: Thick Film; NexarPartId: 87449095; RoHS: Non-Compliant
R3-R10 R15-R18 R37-R43 R51 = CMP-03412-035718-1: AC1206 4.7KΩ 0.25W 1.00%; Manufacturer Part Number: AC1206FR-104K7L; Manufacturer: Yageo; Tolerance: 0.01; Automotive Grade: Grade 0; Voltage Rating: 200V; Lead Free: Yes; Composition: Thick Film; Category: Res; Device Class L2: Resistors; Device Class L1: Passive Components; Ipc Land Pattern Name: RESC310160X55; ComponentLink2URL: http://www.yageo.com/NewPortal/yageodocoutput?fileName=/pdf/R-Chip/PYu-AC_51_RoHS_L_6.pdf; Octopart: https://octopart.com/ac1206fr-104k7l-yageo-84718857; Package: AC1206; ComponentLink2Description: Datasheet; RoHS: TRUE; Resistance: 4.7KΩ; Value: 4.7KΩ; Temperature Range High: +155°C; Device Class L3: Chip SMD Resistors; Footprint Url: http://www.yageo.com/exep/pages/download/literatures/PYu-R_Mount_10.pdf; Temperature Range Low: -55°C; Automotive: Yes; Height: 0.65mm; Series: AC; Power Rating: 0.25W; Temperature: -55°C to +155°C
R11 R13 = CRM1206QFX-1001ELF: 1K resistor 1206; Manufacturer_Name: Bourns; Datasheet Link: http://www.bourns.com/docs/Product-Datasheets/CRM-Q.pdf; Height: 0.65mm; Manufacturer_Part_Number: CRM1206QFX-1001ELF; Mouser Part Number: 652-CRM1206QFX-1001E; Mouser Price/Stock: https://www.mouser.co.uk/ProductDetail/Bourns/CRM1206QFX-1001ELF?qs=8Wlm6%252BaMh8Tjg7l1Rp9ylQ%3D%3D; Arrow Part Number: CRM1206QFX-1001ELF; Arrow Price/Stock: https://www.arrow.com/en/products/crm1206qfx-1001elf/bourns?region=nac
R12 = CRM1206QFX-1001ELF: Resistor; Manufacturer_Name: Bourns; Datasheet Link: http://www.bourns.com/docs/Product-Datasheets/CRM-Q.pdf; Height: 0.65mm; Manufacturer_Part_Number: CRM1206QFX-1001ELF; Mouser Part Number: 652-CRM1206QFX-1001E; Mouser Price/Stock: https://www.mouser.co.uk/ProductDetail/Bourns/CRM1206QFX-1001ELF?qs=8Wlm6%252BaMh8Tjg7l1Rp9ylQ%3D%3D; Arrow Part Number: CRM1206QFX-1001ELF; Arrow Price/Stock: https://www.arrow.com/en/products/crm1206qfx-1001elf/bourns?region=nac
R21-R23 R30 R31 = CMP-08839-029415-1: 300kΩ ±1% 0.5W 1206 Anti-Surge Chip Resistor AEC-Q200; Temperature Coefficient: 100ppm/°C; Resistance: 300kR; Max Power Dissipation: 333mW; Case Code (Imperial): 1206; Package Quantity: 1; Width: 0.063inch; Case Code (Metric): 3216; RoHS Compliant: Yes; Height: 0.026inch; Series: ESR; Resistor Type: Thick Film; Features: Automotive AEC-Q200; Case/Package: 1206; Number of Terminations: 2; Length: 0.126inch; Packaging: Tape and Reel; Max Operating Temperature: 155°C; Min Operating Temperature: -55°C; Tolerance: 1%
R25-R28 R33-R36 R62-R65 R68 R69 = CMP-03412-035718-1: AC1206 4.7KΩ 0.25W 1.00%; Manufacturer: Yageo; Tolerance: 0.01; Automotive Grade: Grade 0; Voltage Rating: 200V; Lead Free: Yes; Composition: Thick Film; Category: Res; Device Class L2: Resistors; Device Class L1: Passive Components; Ipc Land Pattern Name: RESC310160X55; ComponentLink2URL: http://www.yageo.com/NewPortal/yageodocoutput?fileName=/pdf/R-Chip/PYu-AC_51_RoHS_L_6.pdf; Octopart: https://octopart.com/ac1206fr-104k7l-yageo-84718857; Package: AC1206; ComponentLink2Description: Datasheet; RoHS: TRUE; Resistance: 4.7KΩ; Value: 4.7KΩ; Temperature Range High: +155°C; Device Class L3: Chip SMD Resistors; Footprint Url: http://www.yageo.com/exep/pages/download/literatures/PYu-R_Mount_10.pdf; Temperature Range Low: -55°C; Manufacturer Part Number: AC1206FR-104K7L; Automotive: Yes; Height: 0.65mm; Series: AC; Power Rating: 0.25W; Temperature: -55°C to +155°C
R44-R46 R53 R54 R56 = CMP-1014-00623-2: Chip Resistor, 10 KOhm, +/- 1%, 0.25 W, -55 to 155 degC, 1206 (3216 Metric), RoHS, Tape and Reel; Manufacturer: Yageo; Voltage Rating: 200V; Resistance: 10KOhm; Temperature Coefficient: 100ppm/degreesC; Power Rating: 250mW; Packaging: TapeandReel; Termination: SMD/SMT; REACH SVHC: Unknown; Tolerance: 1%; Height: 0.55mm; Composition: ThickFilm; Max Operating Temperature: 155degC; Datasheet Version: Rev. 5, 10/2016; Lead Free: LeadFree; Case Code (Metric): 3216; Depth: 1.6mm; Package Quantity: 5000; RoHSCompliant: true; Military Standard: Not; Case/Package: 1206; Case Code (Imperial): 1206; Min Operating Temperature: -55degC; Datasheet URL: http://www.yageo.com/NewPortal/yageodocoutput?fileName=/pdf/R-Chip/PYu-RC_Group_51_RoHS_L_5.pdf; Length: 3.1mm; Manufacturer URL: http://www.yageo.com/; Package Reference: 1206.0; Width: 1.6mm; Package Description: 2-Pin Surface Mount Device, Body 3.1 x 1.6 mm
R47 R48 R55 R57 = CMP-03412-010240-1: RES SMD 20K OHM 0.25% 1/4W 1206; Manufacturer Part Number: RT1206CRD0720KL; Manufacturer: Yageo; Resistance: 20KΩ; Value: 20KΩ; Temperature Coefficient: 25 ppm/°C; Power Rating: 0.25W; Voltage Rating: 200V; Tolerance: 0.01; ComponentLink2URL: http://www.yageo.com/documents/recent/PYu-RT_1-to-0.01_RoHS_L_9.pdf; Temperature Range Low: -55°C; Device Class L3: Chip SMD Resistors; Lead Free: Yes; Digikey Description: RES SMD 20K OHM 0.25% 1/4W 1206; Category: Res; Automotive: No; Device Class L2: Resistors; Height: 0.65mm; Ipc Land Pattern Name: RESC310160X55; Series: RT; Octopart: https://octopart.com/rt1206crd0720kl-yageo-1258780; ComponentLink2Description: Datasheet; Device Class L1: Passive Components; RoHS: TRUE; Composition: Thin Film; Temperature: -55°C to +155°C; Footprint Url: http://www.yageo.com/exep/pages/download/literatures/PYu-R_Mount_10.pdf; Temperature Range High: +155°C; Package: RT1206
R49 = CMP-2003-00118-2: NexarPartId: 55423295; Voltage Rating: 200V; Temperature Coefficient: 100ppm/°C; Resistance: 15kΩ; Max Power Dissipation: 250mW; Tolerance: 1%; Military Standard: Not; Min Operating Temperature: -55°C; Height: 600µm; Termination: SMD/SMT; Composition: Thick Film; Mount: Surface Mount; Voltage Rating (DC): 200V; Lead Free: Lead Free; Features: Automotive AEC-Q200; Radiation Hardening: No; Number of Terminations: 2; Contact Plating: Tin; Lifecycle Status: Production; Schedule B: 8533210045, 8533210045; Max Operating Temperature: 155°C; Packaging: Cut Tape (CT); Length: 3.2mm; Power Rating: 250mW; Width: 1.6mm; RoHS: Compliant; Number of Pins: 2; Depth: 1.6mm; Case Code (Imperial): 1206; Case/Package: 1206; REACH SVHC: No SVHC; Case Code (Metric): 3216
R58 R59 = AC1206FR-10100RL: Resistor; Manufacturer_Name: KEMET; Datasheet Link: https://www.yageo.com/upload/media/product/productsearch/datasheet/rchip/PYu-AC_51_RoHS_L_9.pdf; Height: 0.65mm; Manufacturer_Part_Number: AC1206FR-10100RL; Mouser Part Number: 603-AC1206FR-10100RL; Mouser Price/Stock: https://www.mouser.com/Search/Refine.aspx?Keyword=603-AC1206FR-10100RL
R60 R61 = CMP-2003-00017-1: Manufacturer: Panasonic; Part Number: ERJ-8ENF1001V
U1-U10 U12 U13 = CMP-04895-000148-1: IC OPAMP GP 2 CIRCUIT 8SOIC
U11 = CMP-1771-00003-1: Push-Pull Four Channel Driver with Diodes, 4.5 to 36 V, 20-Pin SOIC, RoHS, Tube; Voltage Rating: 50 V; Power Rating: 100 mW; Case\Package: 0603; Resistance: 15 kohm; Tolerance: 1%; REACH SVHC: Unknown; Case Code (Imperial): 0603; ComponentLink2Description: Datasheet; ComponentLink2URL: http://www.st.com/content/ccc/resource/technical/document/datasheet/04/ac/22/f9/20/5d/43/a1/CD00000059.pdf/files/CD00000059.pdf/jcr:content/translations/en.CD00000059.pdf; Max Operating Temperature: 155 degC; Width: 0.8 mm; ComponentLink1URL: http://www.st.com/; ComponentLink1Description: Manufacturer URL; Length: 1.6 mm; Package Quantity: 5000; RoHSCompliant: true; Height: 0.45 mm; Mount: Surface Mount; PackageDescription: 20-Pin Small Outline Integrated Circuit, Body 12.8 x 7.5 mm, Pitch 1.27 mm; PackageReference: SOIC-20; Packaging: Tape and Reel; Min Operating Temperature: -55 degC; Case Code (Metric): 1608; DatasheetVersion: Jul-03
VR1 = 3296W-1-101LF: 500 Ohm variable Resistor; Manufacturer_Name: Bourns; Datasheet Link: https://www.bourns.com/pdfs/3296.pdf; Manufacturer_Part_Number: 3296W-1-101LF; Mouser Part Number: 652-3296W-1-101LF; Mouser Price/Stock: https://www.mouser.co.uk/ProductDetail/Bourns/3296W-1-101LF?qs=UcU9LKO1dwEefwKxVJG4Jw%3D%3D; Arrow Part Number: 3296W-1-101LF; Arrow Price/Stock: https://www.arrow.com/en/products/3296w-1-101lf/bourns?region=nac
VR2 VR13-VR16 = 3296W-1-102: Variable Resistor; Manufacturer_Name: Bourns; Datasheet Link: https://www.bourns.com/pdfs/3296.pdf; Manufacturer_Part_Number: 3296W-1-102; Mouser Part Number: 652-3296W-1-102; Mouser Price/Stock: https://www.mouser.co.uk/ProductDetail/Bourns/3296W-1-102?qs=fd0Ij%252BN8svybmCDBgax2Vg%3D%3D; Arrow Part Number: 3296W-1-102; Arrow Price/Stock: https://www.arrow.com/en/products/3296w-1-102/bourns?region=nac
VR3 VR4 VR6 VR8 VR10 = 3296W-1-203LF: 20kOhm Resistor; Manufacturer_Name: Bourns; Datasheet Link: http://www.bourns.com/docs/Product-Datasheets/3296.pdf; Manufacturer_Part_Number: 3296W-1-203LF; Mouser Part Number: 652-3296W-1-203LF; Mouser Price/Stock: https://www.mouser.co.uk/ProductDetail/Bourns/3296W-1-203LF?qs=UBppDQZA%252BGQoINFzp6sGqA%3D%3D; Arrow Part Number: 3296W-1-203LF; Arrow Price/Stock: https://www.arrow.com/en/products/3296w-1-203lf/bourns?region=europe
VR5 VR7 VR11 = 3296W-1-101LF: 100 Ohm variable Resistor; Manufacturer_Name: Bourns; Datasheet Link: https://www.bourns.com/pdfs/3296.pdf; Manufacturer_Part_Number: 3296W-1-101LF; Mouser Part Number: 652-3296W-1-101LF; Mouser Price/Stock: https://www.mouser.co.uk/ProductDetail/Bourns/3296W-1-101LF?qs=UcU9LKO1dwEefwKxVJG4Jw%3D%3D; Arrow Part Number: 3296W-1-101LF; Arrow Price/Stock: https://www.arrow.com/en/products/3296w-1-101lf/bourns?region=nac
VR12 = 3296W-1-203LF: 6kOhm Resistor; Manufacturer_Name: Bourns; Datasheet Link: http://www.bourns.com/docs/Product-Datasheets/3296.pdf; Manufacturer_Part_Number: 3296W-1-203LF; Mouser Part Number: 652-3296W-1-203LF; Mouser Price/Stock: https://www.mouser.co.uk/ProductDetail/Bourns/3296W-1-203LF?qs=UBppDQZA%252BGQoINFzp6sGqA%3D%3D; Arrow Part Number: 3296W-1-203LF; Arrow Price/Stock: https://www.arrow.com/en/products/3296w-1-203lf/bourns?region=europe